# Altium schematic sheet LED Inducator.SchDoc: MCU LED Layer
size 292 x 193 mm; SheetNumber: 5; SheetTotal: 5
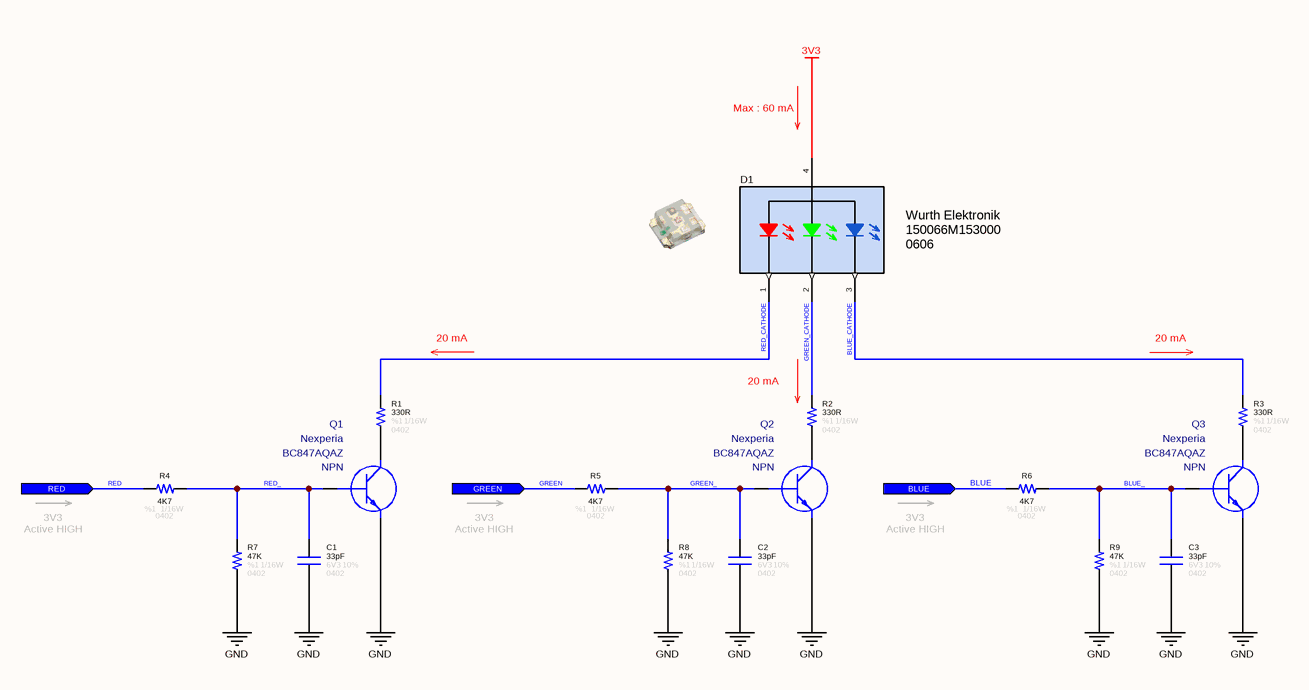
[diagram p0: LED Inducator.SchDoc]

## Parts
C1  value 33pF  Tolerance: 10%  Case: 0402  Voltage: 6V3  [CAPACITOR_0402]  (hidden comment: Capacitor - 33pF [0402] (Ceramic))
C2  value 33pF  Tolerance: 10%  Case: 0402  Voltage: 6V3  [CAPACITOR_0402]  (hidden comment: Capacitor - 33pF [0402] (Ceramic))
C3  value 33pF  Tolerance: 10%  Case: 0402  Voltage: 6V3  [CAPACITOR_0402]  (hidden comment: Capacitor - 33pF [0402] (Ceramic))
D1  Manufacturer Name: Wurth Elektronik  Case: 0606  [Wurth_0606]  (hidden comment: 150066M153000)
Q1  Manufacturer Name: Nexperia  Polarity: NPN  [SOT1215]  (hidden comment: BC847AQAZ)
Q2  Manufacturer Name: Nexperia  Polarity: NPN  [SOT1215]  (hidden comment: BC847AQAZ)
Q3  Manufacturer Name: Nexperia  Polarity: NPN  [SOT1215]  (hidden comment: BC847AQAZ)
R1  value 330R  Case: 0402  Tolerance: %1  Power: 1/16W  [RESISTOR_0402]  (hidden comment: 330R - 0402 - %1 - 1/16W)
R2  value 330R  Case: 0402  Tolerance: %1  Power: 1/16W  [RESISTOR_0402]  (hidden comment: 330R - 0402 - %1 - 1/16W)
R3  value 330R  Case: 0402  Tolerance: %1  Power: 1/16W  [RESISTOR_0402]  (hidden comment: 330R - 0402 - %1 - 1/16W)
R4  value 4K7  Tolerance: %1  Case: 0402  Power: 1/16W  [RESISTOR_0402]  (hidden comment: 4K7 - 0402 - %1 - 1/16W)
R5  value 4K7  Tolerance: %1  Case: 0402  Power: 1/16W  [RESISTOR_0402]  (hidden comment: 4K7 - 0402 - %1 - 1/16W)
R6  value 4K7  Tolerance: %1  Case: 0402  Power: 1/16W  [RESISTOR_0402]  (hidden comment: 4K7 - 0402 - %1 - 1/16W)
R7  value 47K  Tolerance: %1  Case: 0402  Power: 1/16W  [RESISTOR_0402]  (hidden comment: 47K - 0402 - %1 - 1/16W)
R8  value 47K  Tolerance: %1  Case: 0402  Power: 1/16W  [RESISTOR_0402]  (hidden comment: 47K - 0402 - %1 - 1/16W)
R9  value 47K  Tolerance: %1  Case: 0402  Power: 1/16W  [RESISTOR_0402]  (hidden comment: 47K - 0402 - %1 - 1/16W)

## Ports
BLUE (in), GREEN (in), RED (in)

## Nets
3V3: D1.4
GND: C1.1 C2.1 C3.1 Q1.2(E) Q2.2(E) Q3.2(E) R7.1 R8.1 R9.1
BLUE: R6.2 ; port BLUE
BLUE_: C3.2 Q3.1(B) R6.1 R9.2
BLUE_CATHODE: D1.3 R3.2
GREEN: R5.2 ; port GREEN
GREEN_: C2.2 Q2.1(B) R5.1 R8.2
GREEN_CATHODE: D1.2 R2.2
RED: R4.2 ; port RED
RED_: C1.2 Q1.1(B) R4.1 R7.2
RED_CATHODE: D1.1 R1.2
NetQ1_3: Q1.3(C) R1.1
NetQ2_3: Q2.3(C) R2.1
NetQ3_3: Q3.3(C) R3.1

## Notes on the sheet
- Max : 60 mA
- 20 mA
- (near R2) 20 mA
- 3V3
  Active HIGH
- © 2021 All rights reserved.
  This document may not, in whole or in part, be copied, photocopied, reproduced, translated or converted to any electronic or machine readable from without prior written permission of Mehmet Günce Akkoyun.
  Engineer contact : akkoyun@me.com
- Property of
- Engineer :
- Date :
- Size :
- A4
- Time :
- Project :
- Page :
- /
- Customer :
- Product ID :
- Module ID :
- Version :
- File :
- Revision :

## Library data of the parts
C1-C3 = Capacitor - 33pF [0402-6V3]: Manufacturer Name: Kemet; Manufacturer Part Number: C0402C330J9RACAUTO; ComponentLink1Description: DataSheet; ComponentLink1URL: https://api.kemet.com/component-edge/download/datasheet/C0402C330J9RACAUTO.pdf; ComponentLink2Description: Mouser; ComponentLink2URL: https://www.mouser.com/Search/Refine.aspx?Keyword=80-C0402C330J9RAUTO
D1 = Diode - LED-RGB: LED RGB DIFFUSED SMD; If - Forward Current: 20 mA; Vf - Forward Voltage: 2 V, 3.3 V; Product Type: LED; Minimum Operating Temperature: - 40 C; Maximum Operating Temperature: + 85 C; ROHS: Yes; Manufacturer Part Number: 150066M153000
Q1-Q3 = Transistor - BC847: Bipolar NPN Transistors; Case: DFN-1010D-3; Manufacturer Part Number: BC847AQAZ
R1-R3 = Resistor - 330R [0402]: Thick Film Resistors - SMD 1/16 W 330 Ohm 1%; Manufacturer Name: Vishay; Manufacturer Part Number: CRCW0402330RFKED; ComponentLink1Description: DataSheet; ComponentLink1URL: https://www.mouser.com.tr/datasheet/2/427/dcrcwe3-1762152.pdf; ComponentLink2Description: Mouser; ComponentLink2URL: https://www.mouser.com.tr/ProductDetail/Vishay-Dale/CRCW0402330RFKED?qs=sGAEpiMZZMu61qfTUdNhG2DpbjADlD3GGS6SwBlLi5Q%3D
R4-R6 = Resistor - 4K7 [0402]: Thick Film Resistors - SMD 1/16 W 4.7 KOhm 1%; Manufacturer Name: Vishay; Manufacturer Part Number: CRCW04024K70FKED; ComponentLink1Description: DataSheet; ComponentLink1URL: https://www.mouser.com.tr/datasheet/2/427/dcrcwe3-1762152.pdf; ComponentLink2Description: Mouser; ComponentLink2URL: https://www.mouser.com.tr/ProductDetail/Vishay-Dale/CRCW04024K70FKED?qs=sGAEpiMZZMu61qfTUdNhG7nHf%2F6MTUn3HadIdDQu24Q%3D
R7-R9 = Resistor - 47K [0402]: Thick Film Resistors - SMD 1/16 W 47 KOhm 1%; Manufacturer Name: Vishay; Manufacturer Part Number: CRCW040247K0FKED; ComponentLink1Description: DataSheet; ComponentLink1URL: https://www.mouser.com.tr/datasheet/2/427/dcrcwe3-1762152.pdf; ComponentLink2Description: Mouser; ComponentLink2URL: https://www.mouser.com.tr/ProductDetail/Vishay-Dale/CRCW040247K0FKED?qs=sGAEpiMZZMu61qfTUdNhG2DpbjADlD3GL%252B3h1elTxqU%3D